# Altium project actuator_board.PrjPcb
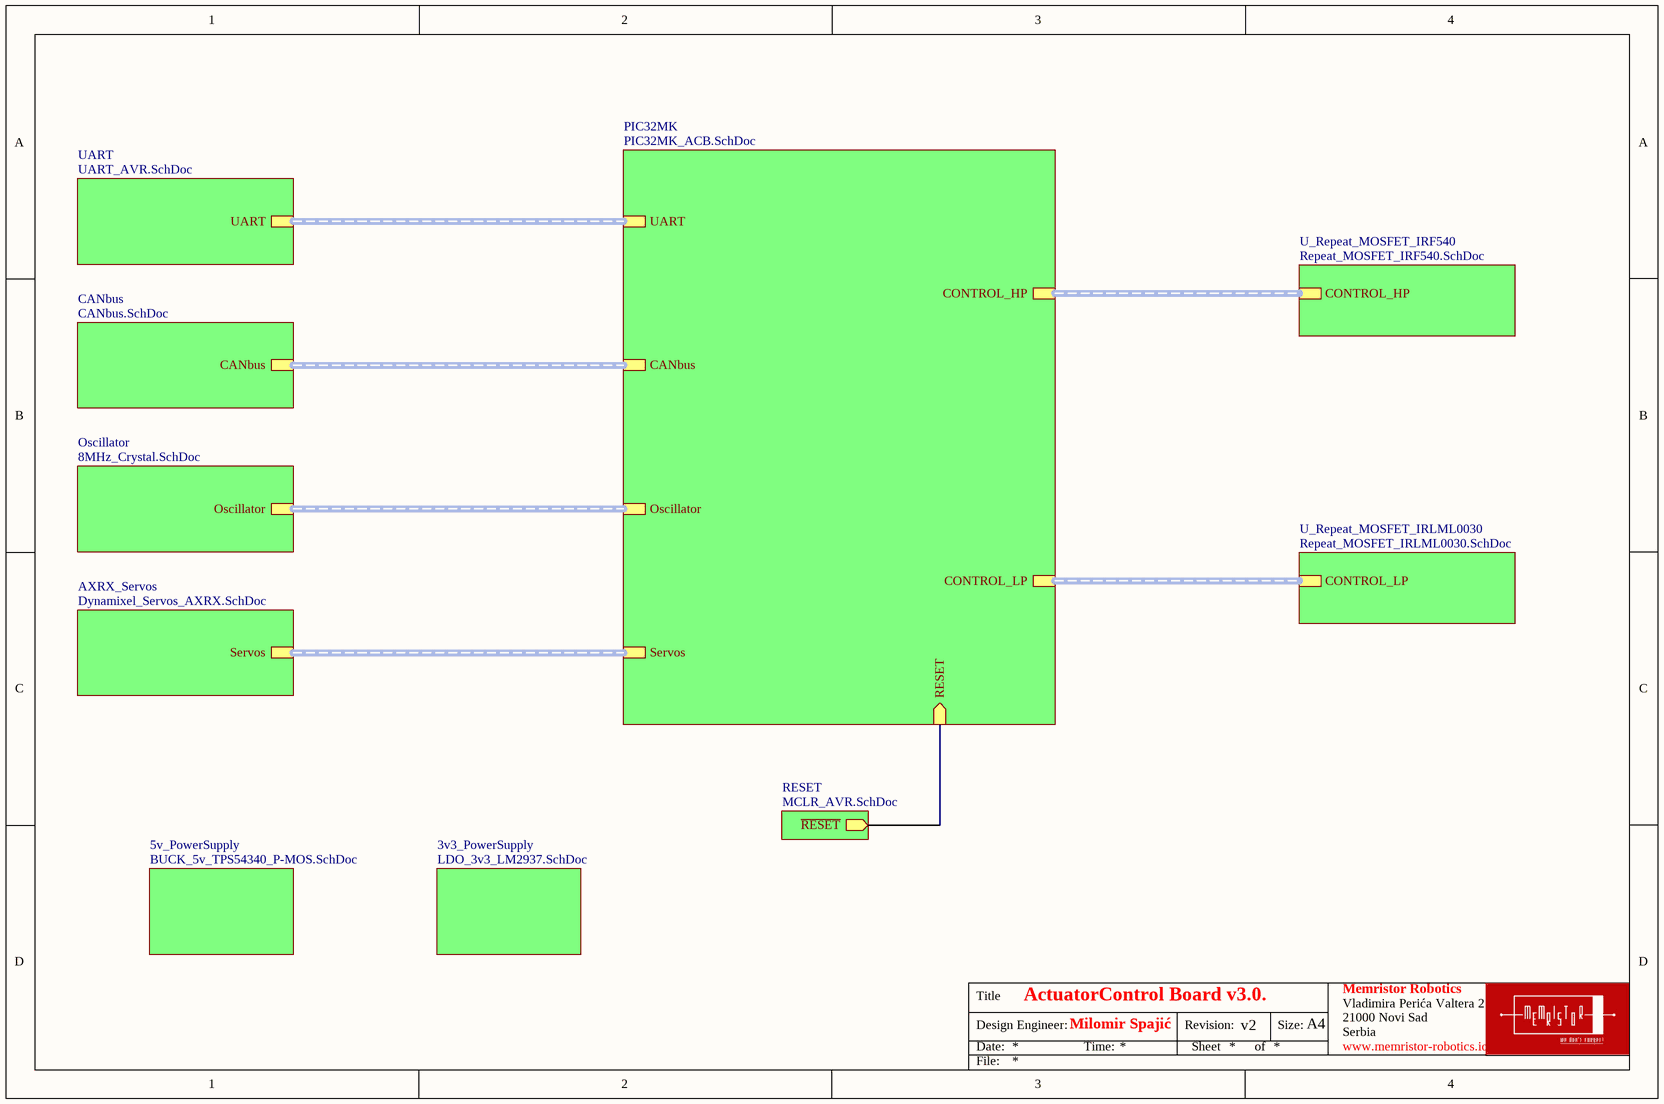
[diagram p0: ActuatorControl_Board_v30.SchDoc]
13 sheets, 147 parts. Net scope: hierarchical (ports join the sheet entries above them; power ports are global).
Board file: ActuatorControl_Board_v30.PcbDoc
Sheets:
  ActuatorControl_Board_v30.SchDoc
    5v_PowerSupply = BUCK_5v_TPS54340_P-MOS.SchDoc
    3v3_PowerSupply = LDO_3v3_LM2937.SchDoc
    RESET = MCLR_AVR.SchDoc
    PIC32MK = PIC32MK_ACB.SchDoc
    UART = UART_AVR.SchDoc
    CANbus = CANbus.SchDoc
    Oscillator = 8MHz_Crystal.SchDoc
    AXRX_Servos = Dynamixel_Servos_AXRX.SchDoc
    U_Repeat_MOSFET_IRF540 = Repeat_MOSFET_IRF540.SchDoc
      MOSFET_IRF5401 = MOSFET_IRF540.SchDoc
      MOSFET_IRF5402 = MOSFET_IRF540.SchDoc
      MOSFET_IRF5403 = MOSFET_IRF540.SchDoc
      MOSFET_IRF5404 = MOSFET_IRF540.SchDoc
      MOSFET_IRF5405 = MOSFET_IRF540.SchDoc
      MOSFET_IRF5406 = MOSFET_IRF540.SchDoc
    U_Repeat_MOSFET_IRLML0030 = Repeat_MOSFET_IRLML0030.SchDoc
      MOSFET_IRLML00301 = MOSFET_IRLML0030.SchDoc
      MOSFET_IRLML00302 = MOSFET_IRLML0030.SchDoc
      MOSFET_IRLML00303 = MOSFET_IRLML0030.SchDoc
      MOSFET_IRLML00304 = MOSFET_IRLML0030.SchDoc
      MOSFET_IRLML00305 = MOSFET_IRLML0030.SchDoc
      MOSFET_IRLML00306 = MOSFET_IRLML0030.SchDoc

## Sheet ActuatorControl_Board_v30.SchDoc: ActuatorControl Board v3.0.
size A4; Author: Milomir Spajić; Organization: Memristor Robotics; Address1: Vladimira Perića Valtera 2; Address2: 21000 Novi Sad; Address3: Serbia; Revision: v2

### Sub-sheets
3v3_PowerSupply = LDO_3v3_LM2937.SchDoc: no entries
5v_PowerSupply = BUCK_5v_TPS54340_P-MOS.SchDoc: no entries
AXRX_Servos = Dynamixel_Servos_AXRX.SchDoc: Servos (harness AXRX_Servos)
CANbus = CANbus.SchDoc: CANbus (harness CANbus)
Oscillator = 8MHz_Crystal.SchDoc: Oscillator (harness Oscillator)
PIC32MK = PIC32MK_ACB.SchDoc: CONTROL_HP (harness CONTROL_HP), CONTROL_LP (harness CONTROL_LP), Oscillator (harness Oscillator), UART (harness UART), Servos (harness AXRX_Servos), CANbus (harness CANbus), RESET (in)
RESET = MCLR_AVR.SchDoc: ~{RESET} (out)
U_Repeat_MOSFET_IRF540 = Repeat_MOSFET_IRF540.SchDoc: CONTROL_HP (harness CONTROL_HP)
U_Repeat_MOSFET_IRLML0030 = Repeat_MOSFET_IRLML0030.SchDoc: CONTROL_LP (harness CONTROL_LP)
UART = UART_AVR.SchDoc: UART (harness UART)

### Nets
~{RESET}: sheet RESET/~{RESET}, sheet PIC32MK/RESET

### Buses and harness runs
harness sheet AXRX_Servos/Servos = sheet PIC32MK/Servos
harness sheet CANbus/CANbus = sheet PIC32MK/CANbus
harness sheet Oscillator/Oscillator = sheet PIC32MK/Oscillator
harness sheet PIC32MK/CONTROL_HP = sheet U_Repeat_MOSFET_IRF540/CONTROL_HP
harness sheet PIC32MK/CONTROL_LP = sheet U_Repeat_MOSFET_IRLML0030/CONTROL_LP
harness sheet PIC32MK/UART = sheet UART/UART

### Notes on the sheet
- Title
- Date:
- Design Engineer:
- Time:
- Revision:
- Sheet
- of
- Size:
- A4
- www.memristor-robotics.io
- File:

## Sheet BUCK_5v_TPS54340_P-MOS.SchDoc: Memristor Power 5.0
size A4; Author: Nikola Rašević; Organization: Memristor-Robotics; Address1: Vladimira Perića Valtera 2; Address2: 21000 Novi Sad; Address3: Serbia; Revision: v1
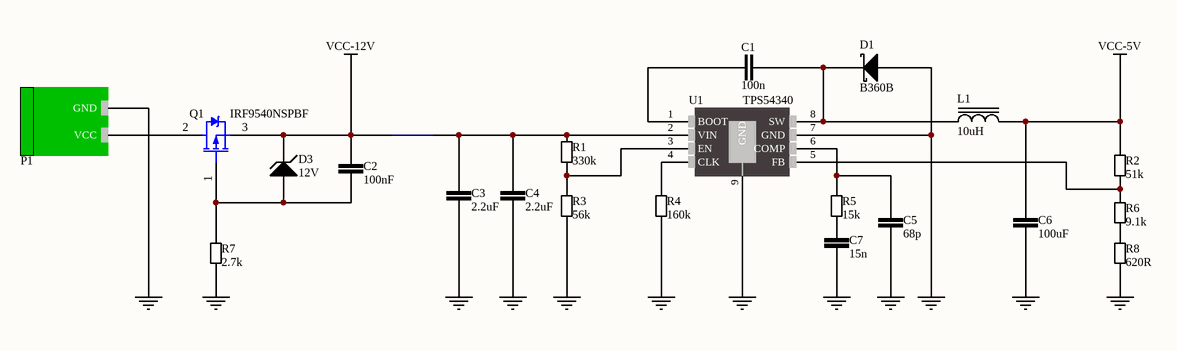
[diagram p1: BUCK_5v_TPS54340_P-MOS.SchDoc]

### Parts
C1  100n  [CER_0603]
C2  100nF  [CER_0805]
C3  2.2uF  [CER_1210]
C4  2.2uF  [CER_1210]
C5  68p  [CER_0603]
C6  100uF  [CER_1210]
C7  15n  [CER_0603]
D1  B360B  [DO214AC]
D3  12V  [DO214AC]
L1  10uH  [INDUCTOR_SS1260-103MLD]
P1  2EDGRC-5.08-02P-14-00A(H)  [PWR_Con]  (value not drawn)
Q1  IRF9540NSPBF  [D2PAK-2]
R1  330k  [RESC2013X38N-0805-NOOVERLAY]
R2  51k  [RESC2013X38N-0805-NOOVERLAY]
R3  56k  [RESC2013X38N-0805-NOOVERLAY]
R4  160k  [RESC2013X38N-0805-NOOVERLAY]
R5  15k  [RESC2013X38N-0805-NOOVERLAY]
R6  9.1k  [RESC2013X38N-0805-NOOVERLAY]
R7  2.7k  [RESC2013X38N-0805-NOOVERLAY]
R8  620R  [RESC2013X38N-0805-NOOVERLAY]
U1  TPS54340  [HSOP-8]

### Nets
GND: C3.1 C4.1 C5.1 C6.1 C7.1 D1.2(Anode) P1.1(GND) R3.1 R4.1 R7.1 R8.1 U1.7(GND) U1.9(GND)
VCC-5V: C6.2 L1.2 R2.2
VCC-12V: C2.2 C3.2 C4.2 D3.1(Cathode) Q1.3(S) R1.2 U1.2(VIN)
NetC1_1: C1.1 U1.1(BOOT)
NetC1_2: C1.2 D1.1(Cathode) L1.1 U1.8(SW)
NetC2_1: C2.1 D3.2(Anode) Q1.1(G) R7.2
NetC5_2: C5.2 R5.2 U1.6(COMP)
NetC7_2: C7.2 R5.1
NetP1_2: P1.2(VCC) Q1.2(D)
NetR1_1: R1.1 R3.2 U1.3(EN)
NetR2_1: R2.1 R6.2 U1.5(FB)
NetR4_2: R4.2 U1.4(CLK)
NetR6_1: R6.1 R8.2

### Notes on the sheet
- Title
- Date:
- Design Engineer:
- Time:
- Revision:
- Sheet
- of
- Size:
- A4
- www.memristor-robotics.io
- File:

### Library data of the parts
C1 = 06032105: CAP CER 100n 10V X5R 10% 0603; Capacitance: 100n
C2 = 00002105: CAP CER 100n 50V X7R 10% 0805; Capacitance: 100nF
C3 C4 = 00001225: CAP CER 2.2u; Value: 2.2uF
C5 = 06032680: CAP CER 68p 0603; Capacitance: 68p
C6 = 00002108: CAP CER 100u X5R 6.3V 10% 1210; Capacitance: 100uF
C7 = 06032153: CAP CER 15n 0603; Capacitance: 15n
D1 = B360B: DIODE SCHOTTKY 60V 3A DO214AC; Manufacturer: Vishay Semiconductor Diodes Division; Barcode: 0100000007488; id: 62; Assembly: SMD; Speed: Fast Recovery =< 500ns, > 200mA (Io); Voltage  Forward: 550mV @ 3A; item_id: 1025; Recommended Rating: Silver; Manufacturer Part Number: B360B; Category: Discrete Semiconductor Products; Datasheet URL: http://www.vishay.com/docs/88896/b330la.pdf; Package Case: DO-214AC, SMA; Family: DIODE; Voltage  DC Reverse: 60V; Current  Average Rectified: 3A; Diode Type: Schottky; Part Type: Discrete Semiconductors
D3 = ZENER: DIODE ZENER; Manufacturer: Vishay Semiconductor Diodes Division; Manufacturer Part Number: B360B; Barcode: 0100000007488; id: 62; Assembly: SMD; Speed: Fast Recovery =< 500ns, > 200mA (Io); Voltage  DC Reverse: 60V; Current  Average Rectified: 3A; Voltage  Forward: 550mV @ 3A; Diode Type: Schottky; item_id: 1025; Recommended Rating: Silver; Category: Discrete Semiconductor Products; Datasheet URL: http://www.vishay.com/docs/88896/b330la.pdf; Package Case: DO-214AC, SMA; Family: DIODE; Part Type: Discrete Semiconductors; Refferent Voltage: 12V
L1 = Inductor_10uH: FIXED IND 10uH 5.3A; Manufacturer: Coilcraft; Manufacturer Part Number: XAL7030-103MEB; Barcode: 2911010049126; id: 7; Assembly: SMD; Tolerance: 20%; Value: 10u; DC Resistance: 62.7mOhm; item_id: 5593; Category: Inductors, Coils, Chokes; Datasheet URL: http://www.mouser.com/ds/2/597/xal7030-270749.pdf; Package Case: 8x8mm; Inductance: 10uH; Current Rating: 5.3A; Family: INDUCTOR; Part Type: Inductor, Transf, Filter, Ferrite
P1 = 00000002: TERM BLOCK HDR 2POS 90DEG 5.08MM; Suplier: TME; Manufacturer Part Number: 2EDGRC-5.08-02P-14-00A(H); Suplier Product Link: https://www.tme.eu/en/details/2edgrc5.08-2p14/pluggable-terminal-blocks/degson-electronics/2edgrc-508-02p-14-00ah/; Price: 0.1304
Q1 = IRF9540N: P-MOS; Manufacturer: INTERNATIONAL RECTIFIER; Manufacturer Part Number: IRF9540NSPBF; Order Code: IRF9540NS; Package: TO-263 SMD; Price: DIN 62.54; Supplier: Comet.rs
R1 = 00003303: RES SMD 330 kOhm 1/8W 0805; Power: 0.125W, 1/8W; Resistance: 330k; Assembly: SMD; Barcode: 00003303
R2 = 00005102: RES SMD 51 kOhm 1/8W 0805; Power: 0.125W, 1/8W; Resistance: 51k; Assembly: SMD; Barcode: 00005102
R3 = 00005602: RES SMD 56 kOhm 1/8W 0805; Power: 0.125W, 1/8W; Barcode: 00004701; Resistance: 56k; Assembly: SMD
R4 = 00001603: RES SMD 160 kOhm 1/8W 0805; Power: 0.125W, 1/8W; Resistance: 160k; Assembly: SMD; Barcode: 00001603
R5 = 00001502: RES SMD 15 kOhm 1/8W 0805; Power: 0.125W, 1/8W; Resistance: 15k; Assembly: SMD; Barcode: 00001502
R6 = 00009101: RES SMD 9.1 kOhm 1/8W 0805; Power: 0.125W, 1/8W; Resistance: 9.1k; Assembly: SMD; Barcode: 00009101
R7 = 00002701: RES SMD 2.7 kOhm 1/8W 0805; Power: 0.125W, 1/8W; Barcode: 00004701; Resistance: 2.7k; Assembly: SMD
R8 = 00006200: RES SMD 620 Ohm 1/8W 0805; Power: 0.125W, 1/8W; Resistance: 620R; Assembly: SMD; Barcode: 00006200
U1 = TPS54340: IC REG BUCK ADJ 3.5A 8SOPWRPAD; Assembly: SMD; Manufacturer Part Number: TPS54340

## Sheet LDO_3v3_LM2937.SchDoc: 3v3 LDO Module
size A4; Author: Nikola Rašević; Organization: Memristor Robotics
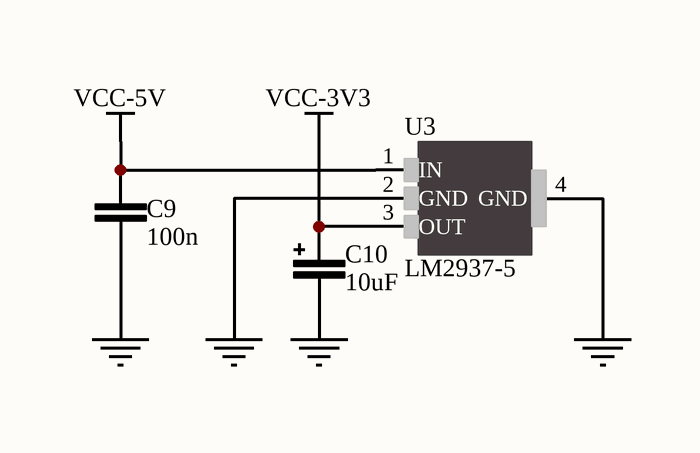
[diagram p2: LDO_3v3_LM2937.SchDoc]

### Parts
C9  100n  [CER_0603]
C10  10uF  [TANT_1210]
U3  LM2937-5  [SOT223]

### Nets
GND: C9.1 C10.2 U3.2(GND) U3.4(GND)
VCC-3V3: C10.1 U3.3(OUT)
VCC-5V: C9.2 U3.1(IN)

### Notes on the sheet
- Title
- Date:
- Design Engineer:
- Time:
- Revision:
- Sheet
- of
- Size:
- A4
- www.memristor-robotics.io
- File:

### Library data of the parts
C9 = 06032105: CAP CER 100n 10V X5R 10% 0603; Capacitance: 100n
C10 = 00001106: CAP TANT 10u; Value: 10uF
U3 = 00000007: IC REG LINEAR 5V 400MA SOT223-4; Manufacturer Part Number: LM2937-5; Datasheet Link: http://www.ti.com/lit/ds/symlink/lm2937.pdf

## Sheet MCLR_AVR.SchDoc: MCU Reset Module
size A4; Author: Nikola Rašević; Organization: Memristor Robotics
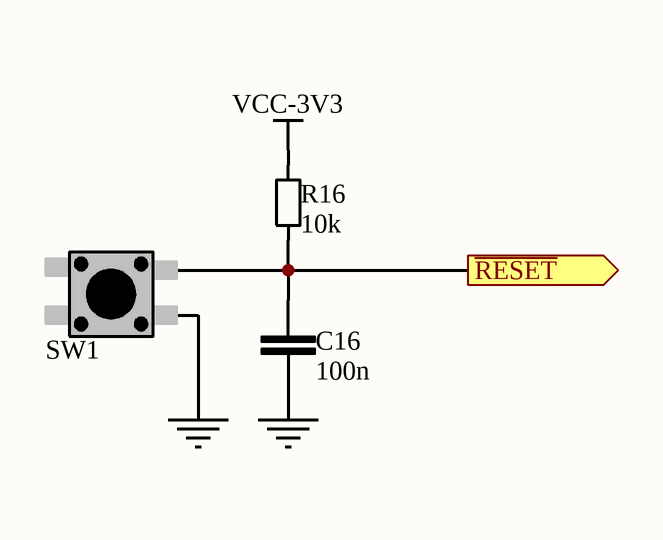
[diagram p3: MCLR_AVR.SchDoc]

### Parts
C16  100n  [CER_0603]
R16  10k  [RESC2013X38N-0805-NOOVERLAY]
SW1  TASTER  [TASTER_SMD]  (value not drawn)

### Ports
~{RESET} (out)

### Nets
GND: C16.1 SW1.1
VCC-3V3: R16.2
~{RESET}: C16.2 R16.1 SW1.2 ; port ~{RESET}

### Notes on the sheet
- Title
- Date:
- Design Engineer:
- Time:
- Revision:
- Sheet
- of
- Size:
- A4
- www.memristor-robotics.io
- File:

### Library data of the parts
C16 = 06032105: CAP CER 100n 10V X5R 10% 0603; Capacitance: 100n
R16 = 000001002: RES SMD 10 kOhm 1/8W 0805; Resistance: 10k

## Sheet PIC32MK_ACB.SchDoc: PIC32MK
size A4; Author: Milomir Spajić; Organization: Memristor-Robotics; Address1: Vladimira Perića Valtera; Address2: Novi Sad, 21000; Address3: Serbia; SheetNumber: 8; SheetTotal: 13
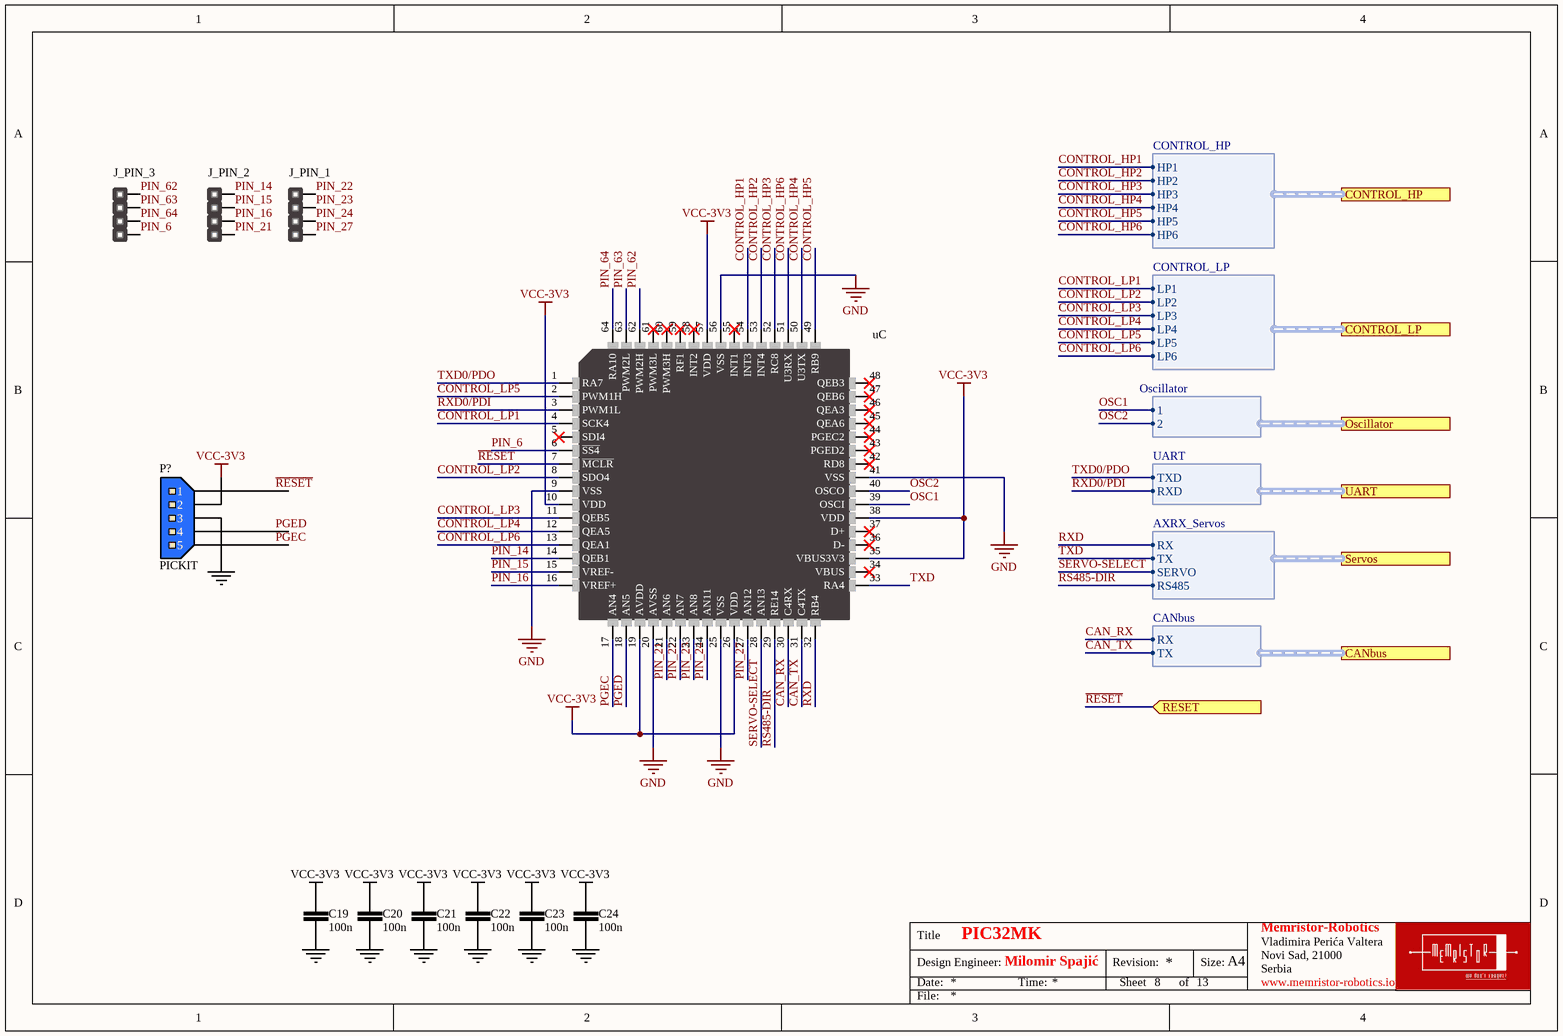
[diagram p4: PIC32MK_ACB.SchDoc]

### Parts
C19  100n  [CER_0603]
C20  100n  [CER_0603]
C21  100n  [CER_0603]
C22  100n  [CER_0603]
C23  100n  [CER_0603]
C24  100n  [CER_0603]
J_PIN_1  HEADER_1x4  [HM1X4]  (value not drawn)
J_PIN_2  HEADER_1x4  [HM1X4]  (value not drawn)
J_PIN_3  HEADER_1x4  [HM1X4]  (value not drawn)
P?  PICKIT  [TE CONNECTIVITY_5PIN_MALE]
uC  (no value)  [TQFP-64-500um]

### Ports
CANbus (harness CANbus), CONTROL_HP (harness CONTROL_HP), CONTROL_LP (harness CONTROL_LP), Oscillator (harness Oscillator), RESET (in), Servos (harness AXRX_Servos), UART (harness UART)

### Harnesses
CONTROL_HP: HP1, HP2, HP3, HP4, HP5, HP6
CONTROL_LP: LP1, LP2, LP3, LP4, LP5, LP6
Oscillator: 1, 2
UART: TXD, RXD
AXRX_Servos: RX, TX, SERVO, RS485
CANbus: RX, TX

### Nets
GND: C19.1 C20.1 C21.1 C22.1 C23.1 C24.1 P?.3 uC.9(VSS) uC.20(AVSS) uC.25(VSS) uC.41(VSS) uC.56(VSS)
VCC-3V3: C19.2 C20.2 C21.2 C22.2 C23.2 C24.2 P?.2 uC.10(VDD) uC.19(AVDD) uC.26(VDD) uC.35(VBUS3V3) uC.38(VDD) uC.57(VDD)
CAN_RX: uC.30(C4RX) ; port CANbus.RX
CAN_TX: uC.31(C4TX) ; port CANbus.TX
CONTROL_HP1: uC.54(INT3) ; port CONTROL_HP.HP1
CONTROL_HP2: uC.53(INT4) ; port CONTROL_HP.HP2
CONTROL_HP3: uC.52(RC8) ; port CONTROL_HP.HP3
CONTROL_HP4: uC.50(U3TX) ; port CONTROL_HP.HP4
CONTROL_HP5: uC.49(RB9) ; port CONTROL_HP.HP5
CONTROL_HP6: uC.51(U3RX) ; port CONTROL_HP.HP6
CONTROL_LP1: uC.4(SCK4) ; port CONTROL_LP.LP1
CONTROL_LP2: uC.8(SDO4) ; port CONTROL_LP.LP2
CONTROL_LP3: uC.11(QEB5) ; port CONTROL_LP.LP3
CONTROL_LP4: uC.12(QEA5) ; port CONTROL_LP.LP4
CONTROL_LP5: uC.2(PWM1H) ; port CONTROL_LP.LP5
CONTROL_LP6: uC.13(QEA1) ; port CONTROL_LP.LP6
OSC1: uC.39(OSCI) ; port Oscillator.1
OSC2: uC.40(OSCO) ; port Oscillator.2
PGEC: P?.5 uC.17(AN4)
PGED: P?.4 uC.18(AN5)
PIN_6: J_PIN_3.1 uC.6(~{SS4})
PIN_14: J_PIN_2.4 uC.14(QEB1)
PIN_15: J_PIN_2.3 uC.15(VREF-)
PIN_16: J_PIN_2.2 uC.16(VREF+)
PIN_21: J_PIN_2.1 uC.21(AN6)
PIN_22: J_PIN_1.4 uC.22(AN7)
PIN_23: J_PIN_1.3 uC.23(AN8)
PIN_24: J_PIN_1.2 uC.24(AN11)
PIN_27: J_PIN_1.1 uC.27(AN12)
PIN_62: J_PIN_3.4 uC.62(PWM2H)
PIN_63: J_PIN_3.3 uC.63(PWM2L)
PIN_64: J_PIN_3.2 uC.64(RA10)
~{RESET}: P?.1 uC.7(~{MCLR}) ; port RESET
RS485-DIR: uC.29(RE14) ; port Servos.RS485
RXD: uC.32(RB4) ; port Servos.RX
RXD0/PDI: uC.3(PWM1L) ; port UART.RXD
SERVO-SELECT: uC.28(AN13) ; port Servos.SERVO
TXD: uC.33(RA4) ; port Servos.TX
TXD0/PDO: uC.1(RA7) ; port UART.TXD

Not connected (* = marked no-connect by the designer): uC 5(SDI4)* 34(VBUS)* 36(D-)* 37(D+)* 42(RD8)* 43(PGED2)* 44(PGEC2)* 45(QEA6)* 46(QEA3)* 47(QEB6)* 48(QEB3)* 55(INT1)* 58(INT2)* 59(RF1)* 60(PWM3H)* 61(PWM3L)*

### Notes on the sheet
- Title
- Date:
- Design Engineer:
- Time:
- Revision:
- Sheet
- of
- Size:
- A4
- www.memristor-robotics.io
- File:

### Library data of the parts
C19-C24 = 06032105: CAP CER 100n 10V X5R 10% 0603; Capacitance: 100n
P? = TE CONNECTIVITY_5PIN_MALE: BLUE_5PIN_CONECTOR; Manufacturer: TE CONNECTIVITY / AMP; Manufacturer Part Number 1: 281695-3; Order Code 1: 1205983; Price 1: £0.403; Supplier 1: uk.farnell.com
uC = PIC32MK1024MCF064: IC MCU 32BIT 1MB FLASH 64TQFP; Manufacturer Part Number: PIC32MK1024MCF064

## Sheet UART_AVR.SchDoc: MCU UART Module
size A4; Author: Nikola Rašević; Organization: Memristor Robotics
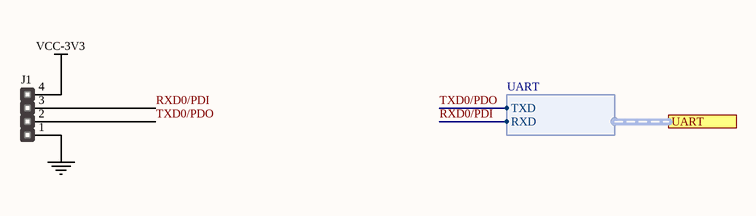
[diagram p5: UART_AVR.SchDoc]

### Parts
J1  HEADER_1x4  [HM1X4]  (value not drawn)

### Ports
UART (harness UART)

### Harnesses
UART: TXD, RXD

### Nets
GND: J1.1
VCC-3V3: J1.4
RXD0/PDI: J1.3 ; port UART.RXD
TXD0/PDO: J1.2 ; port UART.TXD

### Notes on the sheet
- Title
- Date:
- Design Engineer:
- Time:
- Revision:
- Sheet
- of
- Size:
- A4
- www.memristor-robotics.io
- File:

## Sheet CANbus.SchDoc: CANbus Module
size A4; Author: Nikola Rašević; Organization: Memristor Robotics
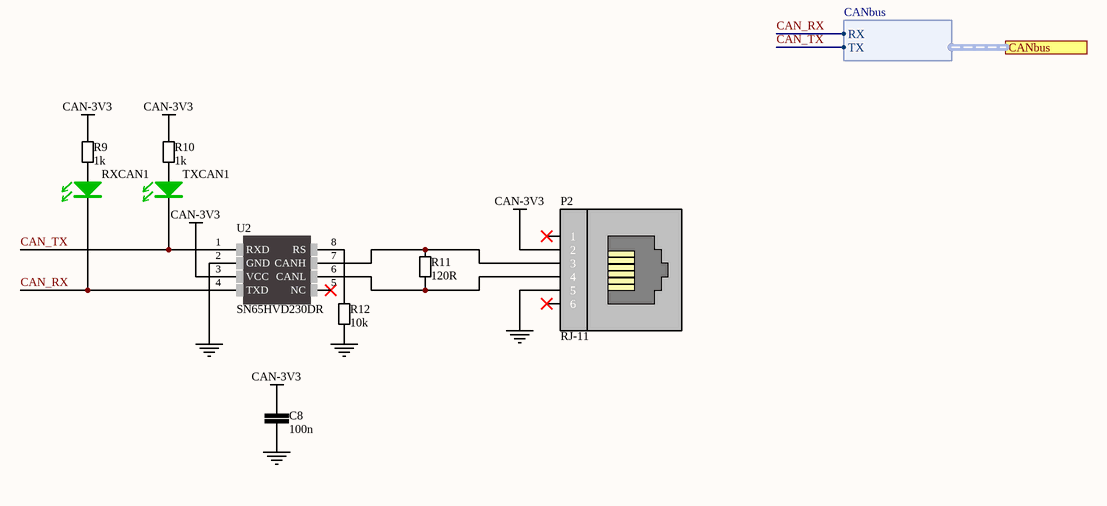
[diagram p6: CANbus.SchDoc]

### Parts
C8  100n  [CER_0603]
P2  RJ-11  [RJ11-6N-B]
R9  1k  [RESC2013X38N-0805-NOOVERLAY]
R10  1k  [RESC2013X38N-0805-NOOVERLAY]
R11  120R  [RESC2013X38N-0805-NOOVERLAY]
R12  10k  [RESC2013X38N-0805-NOOVERLAY]
RXCAN1  LED GREEN  [LED_GREEN_0805]  (value not drawn)
TXCAN1  LED GREEN  [LED_GREEN_0805]  (value not drawn)
U2  SN65HVD230DR  [SOIC-8]

### Ports
CANbus (harness CANbus)

### Harnesses
CANbus: RX, TX

### Nets
CAN-3V3: C8.2 P2.2 R9.2 R10.2 U2.3(VCC)
GND: C8.1 P2.5 R12.1 U2.2(GND)
CAN_RX: RXCAN1.1(C) U2.4(TXD) ; port CANbus.RX
CAN_TX: TXCAN1.1(C) U2.1(RXD) ; port CANbus.TX
NetP2_3: P2.3 R11.1 U2.7(CANH)
NetP2_4: P2.4 R11.2 U2.6(CANL)
NetR9_1: R9.1 RXCAN1.2(A)
NetR10_1: R10.1 TXCAN1.2(A)
NetR12_2: R12.2 U2.8(RS)

Not connected (* = marked no-connect by the designer): P2 1* 6*; U2 5(NC)*

### Notes on the sheet
- Title
- Date:
- Design Engineer:
- Time:
- Revision:
- Sheet
- of
- Size:
- A4
- www.memristor-robotics.io
- File:

### Library data of the parts
C8 = 06032105: CAP CER 100n 10V X5R 10% 0603; Capacitance: 100n
P2 = 00000001: Manufacturer Part Number: RJ-11
R9 R10 = 00001001: RES SMD 1 kOhm 1/8W 0805; Power: 0.125W, 1/8W; Barcode: 00009101; Resistance: 1k; Assembly: SMD
R11 = 000001200: RES SMD 120 Ohm 1/8W 0805; Resistance: 120R
R12 = 000001002: RES SMD 10 kOhm 1/8W 0805; Resistance: 10k
RXCAN1 TXCAN1 = LED_GREEN 0805: LED GREEN CLEAR 0805 SMD; Manufacturer: Kingbright; Manufacturer Part Number: APT2012SGC; Barcode: 2911010024338; id: 28; Voltage Forward: 2.2V; Wavelength: 568nm; Lens Color: Colorless; item_id: 3342; Recommended Rating: Platinum; Category: Optoelectronics; Assembly: SMD; Datasheet URL: http://www.kingbrightusa.com/images/catalog/SPEC/APT2012SGC.pdf; Package Case: 0805 (2012 Metric); Color: Green; Family: LED; Lens Transparency: Clear; Part Type: Optoelectronics
U2 = SN65HVD230: IC EMC CAN TRANSCEIVER 8-SOIC; Assembly: SMD; Barcode: 00000001; Manufacturer Part Number: SN65HVD230DR; Comet Product Page: http://store.comet.rs/Catalogue/Product/9057/; Datasheet Link: http://www.ti.com/lit/ds/symlink/sn65hvd232.pdf; Category: Integrated Circuits (ICs); Package: SOIC-8; Family: Comunication

## Sheet 8MHz_Crystal.SchDoc: 8MHz Crystal Oscillator Module
size A4; Author: Nikola Rašević; Organization: Memristor Robotics
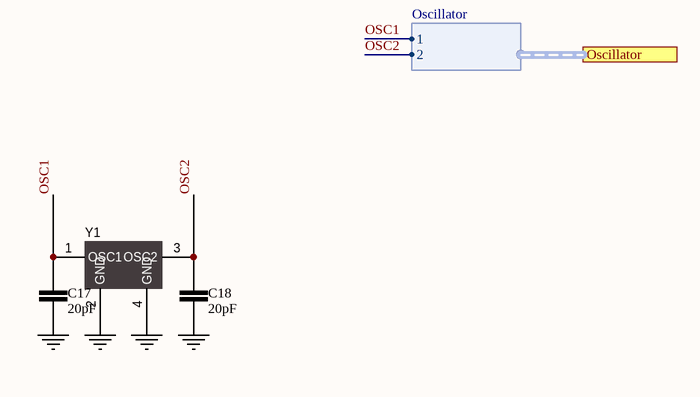
[diagram p7: 8MHz_Crystal.SchDoc]

### Parts
C17  20pF  [CER_0603]
C18  20pF  [CER_0603]
Y1  8Hz  [ABM10]  (value not drawn)

### Ports
Oscillator (harness Oscillator)

### Harnesses
Oscillator: 1, 2

### Nets
GND: C17.1 C18.1 Y1.2(GND) Y1.4(GND)
OSC1: C17.2 Y1.1(OSC1) ; port Oscillator.1
OSC2: C18.2 Y1.3(OSC2) ; port Oscillator.2

### Notes on the sheet
- Title
- Date:
- Design Engineer:
- Time:
- Revision:
- Sheet
- of
- Size:
- A4
- www.memristor-robotics.io
- File:

### Library data of the parts
C17 C18 = 00002200: CAP CER 20p 0805; Capacitance: 20pF
Y1 = QUARTZ_8MHz: CRYSTAL 8.0000MHZ 18PF SMD; Manufacturer: ABRACON; Manufacturer Part Number: ABMM2-8.000MHZ-E2-T; id: 17; Frequency Stability: ±30ppm; Equivalent Series Resistance: 72 Ohm; item_id: 4360; Category: Crystals and Oscillators; Assembly: SMD; Datasheet URL: http://www.abracon.com/Resonators/ABMM2.pdf; Package Case: 4-SMD, No Lead (DFN, LCC); Frequency: 8Hz; Frequency Tolerance: ±30ppm; Load Capacitance: 18pF; Family: CRYSTAL; Size Dimension: 0.126" L x 0.098" W (3.20mm x 2.50mm); Part Type: Crystals, Oscillators

## Sheet Dynamixel_Servos_AXRX.SchDoc: Dynamixel Servoes Module
size A4; Author: Nikola Rašević; Organization: Memristor Robotics
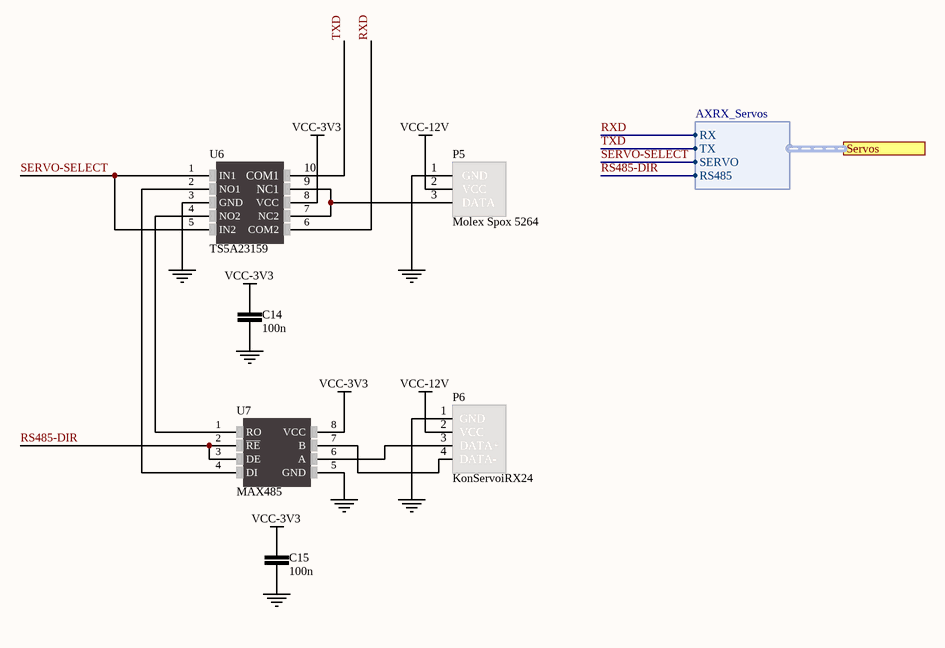
[diagram p8: Dynamixel_Servos_AXRX.SchDoc]

### Parts
C14  100n  [CER_0603]
C15  100n  [CER_0603]
P5  Molex Spox 5264  [AX12_Molex Spox 5264]
P6  KonServoiRX24  [RX24_Molex Spox 5264]
U6  TS5A23159  [TSSOP10]
U7  MAX485  [SOIC-8]

### Ports
Servos (harness AXRX_Servos)

### Harnesses
AXRX_Servos: RX, TX, SERVO, RS485

### Nets
GND: C14.1 C15.1 P5.1(GND) P6.1(GND) U6.3(GND) U7.5(GND)
VCC-3V3: C14.2 C15.2 U6.8(VCC) U7.8(VCC)
VCC-12V: P5.2(VCC) P6.2(VCC)
RS485-DIR: U7.2(~{RE}) U7.3(DE) ; port Servos.RS485
RXD: U6.6(COM2) ; port Servos.RX
SERVO-SELECT: U6.1(IN1) U6.5(IN2) ; port Servos.SERVO
TXD: U6.10(COM1) ; port Servos.TX
NetP5_3: P5.3(DATA) U6.7(NC2) U6.9(NC1)
NetP6_3: P6.3(DATA+) U7.6(A)
NetP6_4: P6.4(DATA-) U7.7(B)
NetU6_2: U6.2(NO1) U7.4(DI)
NetU6_4: U6.4(NO2) U7.1(RO)

### Notes on the sheet
- Title
- Date:
- Design Engineer:
- Time:
- Revision:
- Sheet
- of
- Size:
- A4
- www.memristor-robotics.io
- File:

### Library data of the parts
C14 C15 = 06032105: CAP CER 100n 10V X5R 10% 0603; Capacitance: 100n
P5 = AX12_CONECTOR: KonServoiAX12; Manufacturer Part Number 1: 22035045; Order Code 1: 1104204; Manufacturer: Molex; Supplier 1: uk.farnell.com; Price 1: £0.104
P6 = RX24_CONECTOR: Molex Spox 5264; Manufacturer Part Number 1: 22035045; Order Code 1: 1104204; Manufacturer: Molex; Supplier 1: uk.farnell.com; Price 1: £0.104
U6 = 00000008_1: IC SWITCH DUAL SPDT 10MSOP; Manufacturer Part Number: TS5A23159
U7 = 00000008: IC TXRX RS485/RS422 8-SOIC; Manufacturer Part Number: MAX485

## Sheet Repeat_MOSFET_IRF540.SchDoc: Repeat High Power MOSFET
size A4; Author: Milomir Spajić; Organization: Memristor-Robotics; Address1: Vladimira Perića Valtera; Address2: Novi Sad, 21000; Address3: Serbia
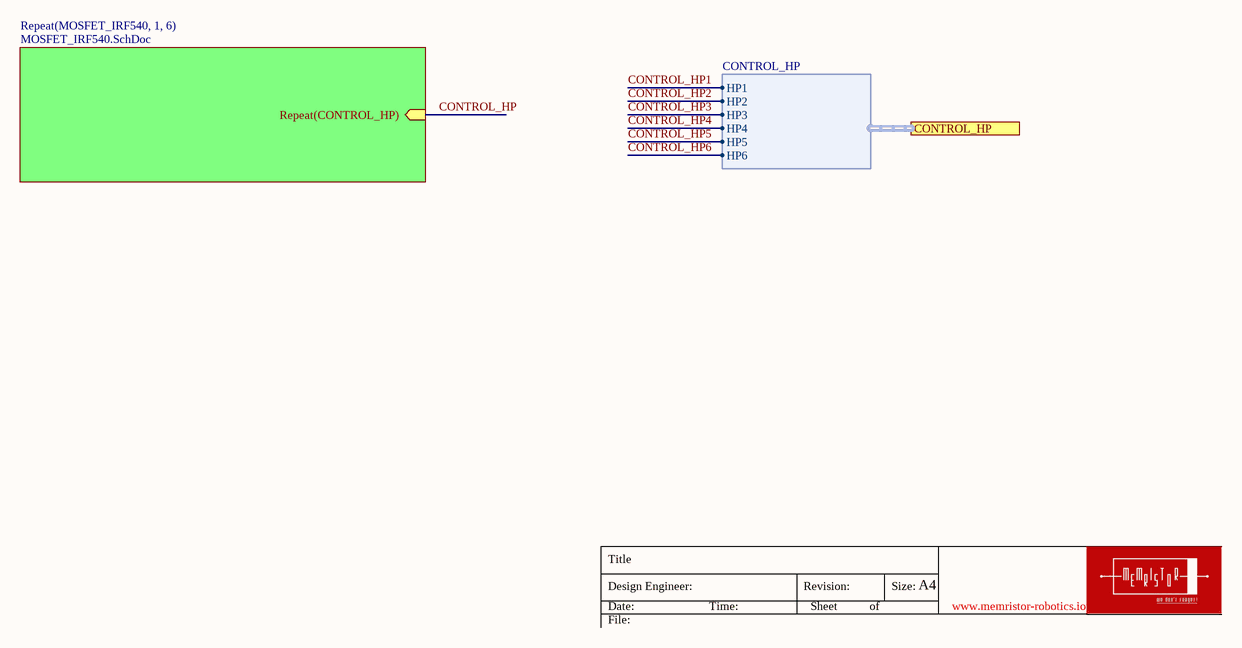
[diagram p9: Repeat_MOSFET_IRF540.SchDoc]

### Sub-sheets
Repeat(MOSFET_IRF540, 1, 6) = MOSFET_IRF540.SchDoc: Repeat(CONTROL_HP) (in)

### Ports
CONTROL_HP (harness CONTROL_HP)

### Harnesses
CONTROL_HP: HP1, HP2, HP3, HP4, HP5, HP6

### Notes on the sheet
- Title
- Date:
- Design Engineer:
- Time:
- Revision:
- Sheet
- of
- Size:
- A4
- www.memristor-robotics.io
- File:

## Sheet MOSFET_IRF540.SchDoc: High Power MOSFET
size A4; Author: Nikola Rašević; Organization: Memristor Robotics
Used 6 times, as channels U_Repeat_MOSFET_IRF540/MOSFET_IRF5401, U_Repeat_MOSFET_IRF540/MOSFET_IRF5402, U_Repeat_MOSFET_IRF540/MOSFET_IRF5403, U_Repeat_MOSFET_IRF540/MOSFET_IRF5404, U_Repeat_MOSFET_IRF540/MOSFET_IRF5405, U_Repeat_MOSFET_IRF540/MOSFET_IRF5406. Parts and nets are listed once, with the designators drawn on the sheet.
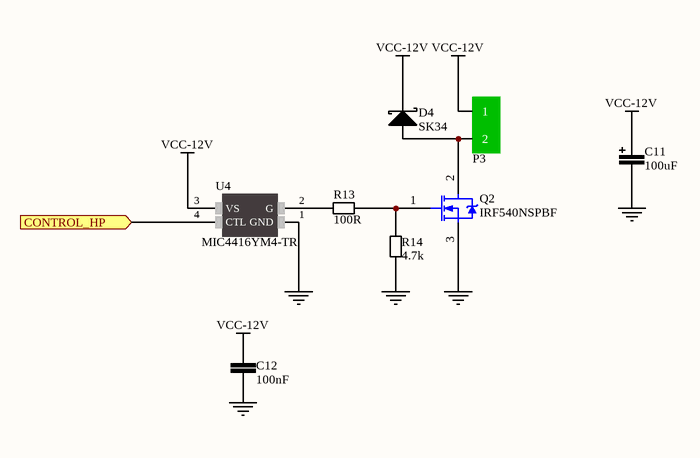
[diagram p10: MOSFET_IRF540.SchDoc]

### Parts
C11  100uF  [CAP5X11_RADIAL]
C12  100nF  [CER_0805]
D4  SK34  [DO214AC]
P3  DRV_B3  [MOTOR_CON]  (value not drawn)
Q2  IRF540NSPBF  [D2PAK-2]
R13  100R  [RESC2013X38N-0805-NOOVERLAY]
R14  4.7k  [RESC2013X38N-0805-NOOVERLAY]
U4  MIC4416YM4-TR  [SOT143-4]

### Ports
CONTROL_HP (in)

### Nets
GND: C11.2 C12.1 Q2.3(S) R14.1 U4.1(GND)
VCC-12V: C11.1 C12.2 D4.1(Cathode) P3.1 U4.3(VS)
CONTROL_HP: U4.4(CTL) ; port CONTROL_HP
NetD4_2: D4.2(Anode) P3.2 Q2.2(D)
NetQ2_1: Q2.1(G) R13.2 R14.2
NetR13_1: R13.1 U4.2(G)

### Channels
U_Repeat_MOSFET_IRF540/MOSFET_IRF5401: designators end in _MOSFET_IRF5401; ports CONTROL_HP=CONTROL_HP1
U_Repeat_MOSFET_IRF540/MOSFET_IRF5402: designators end in _MOSFET_IRF5402; ports CONTROL_HP=CONTROL_HP2
U_Repeat_MOSFET_IRF540/MOSFET_IRF5403: designators end in _MOSFET_IRF5403; ports CONTROL_HP=CONTROL_HP3
U_Repeat_MOSFET_IRF540/MOSFET_IRF5404: designators end in _MOSFET_IRF5404; ports CONTROL_HP=CONTROL_HP4
U_Repeat_MOSFET_IRF540/MOSFET_IRF5405: designators end in _MOSFET_IRF5405; ports CONTROL_HP=CONTROL_HP5
U_Repeat_MOSFET_IRF540/MOSFET_IRF5406: designators end in _MOSFET_IRF5406; ports CONTROL_HP=CONTROL_HP6

### Notes on the sheet
- Title
- Date:
- Design Engineer:
- Time:
- Revision:
- Sheet
- of
- Size:
- A4
- www.memristor-robotics.io
- File:

### Library data of the parts
C11 = 00004704: CAP ALU 4.7u 25V 20%; Capacitance: 100uF
C12 = 00002105: CAP CER 100n 50V X7R 10% 0805; Capacitance: 100nF
D4 = SK34: DIODE SCHOTTKY 40V 3A DO214AC; Manufacturer: Vishay Semiconductor Diodes Division; Barcode: 0100000007488; id: 62; Assembly: SMD; Speed: Fast Recovery =< 500ns, > 200mA (Io); Voltage  Forward: 550mV @ 3A; item_id: 1025; Recommended Rating: Silver; Manufacturer Part Number: SK34; Category: Discrete Semiconductor Products; Datasheet URL: http://www.vishay.com/docs/88896/b330la.pdf; Package Case: DO-214AC, SMA; Family: DIODE; Voltage  DC Reverse: 40V; Current  Average Rectified: 3A; Diode Type: Schottky; Part Type: Discrete Semiconductors
P3 = MOT_CONN: CONNECTOR FOR MOTOR OUTPUT; Manufacturer Part Number: *
Q2 = IRF540N: N-MOS; Manufacturer: INTERNATIONAL RECTIFIER; Manufacturer Part Number: IRF540NSPBF; Order Code: IRF540NS; Package: TO-263 SMD; Price: DIN 62.54; Supplier: Comet.rs
R13 = 00001000: RES SMD 100 Ohm 1/8W 0805; Power: 0.125W, 1/8W; Resistance: 100R; Assembly: SMD; Barcode: 00001000
R14 = 00004701: RES SMD 4.7 kOhm 1/8W 0805; Power: 0.125W, 1/8W; Resistance: 4.7k; Assembly: SMD; Barcode: 00004701
U4 = MIC4416: IC DRIVER MOSF LOW SIDE SOT143-4; Assembly: SMD; Manufacturer Part Number: MIC4416YM4-TR; Datasheet Link: http://ww1.microchip.com/downloads/en/DeviceDoc/mic4416.pdf; Category: Integrated Circuits (ICs); Package: SOT-143; Family: MOSFET Driver; Product Page Farnell: http://uk.farnell.com/microchip/mic4416ym4-tr/driver-mosfet-low-side-smd-4416/dp/2510112

## Sheet Repeat_MOSFET_IRLML0030.SchDoc: Repeat Low Power MOSFET
size A4; Author: Milomir Spajić; Organization: Memristor-Robotics; Address1: Vladimira Perića Valtera; Address2: Novi Sad, 21000; Address3: Serbia; SheetNumber: 11; SheetTotal: 13
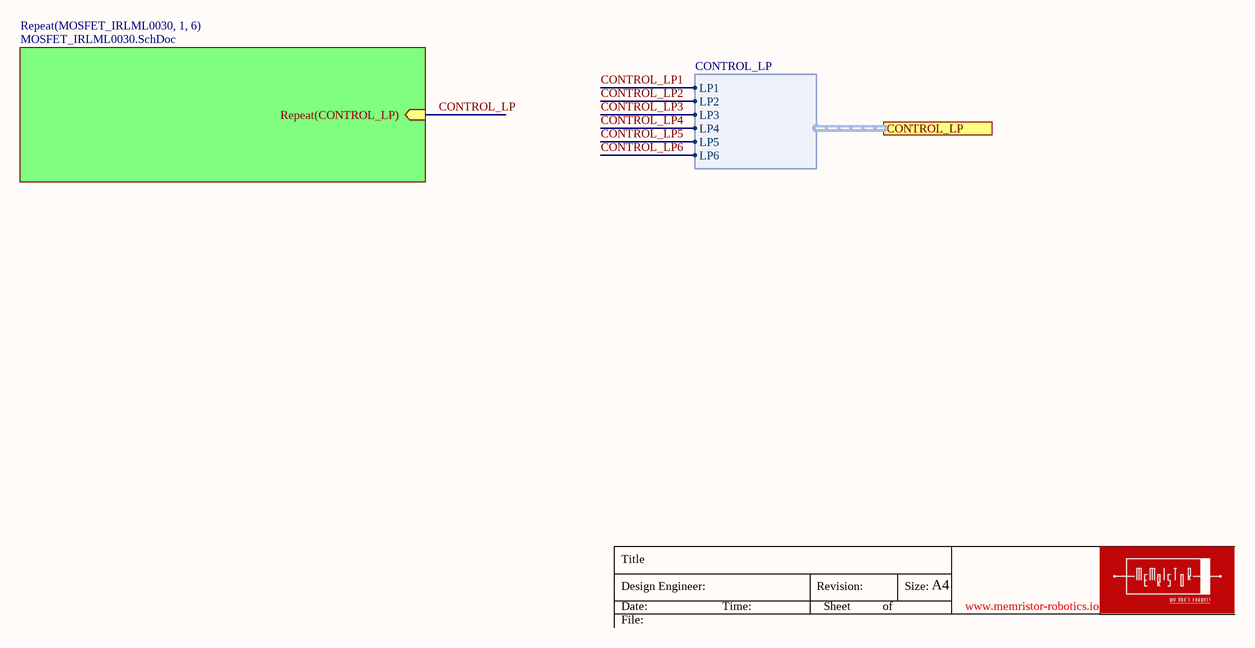
[diagram p11: Repeat_MOSFET_IRLML0030.SchDoc]

### Sub-sheets
Repeat(MOSFET_IRLML0030, 1, 6) = MOSFET_IRLML0030.SchDoc: Repeat(CONTROL_LP) (in)

### Ports
CONTROL_LP (harness CONTROL_LP)

### Harnesses
CONTROL_LP: LP1, LP2, LP3, LP4, LP5, LP6

### Notes on the sheet
- Title
- Date:
- Design Engineer:
- Time:
- Revision:
- Sheet
- of
- Size:
- A4
- www.memristor-robotics.io
- File:

## Sheet MOSFET_IRLML0030.SchDoc: Low Power MOSFET
size A4; Author: Nikola Rašević; Organization: Memristor Robotics
Used 6 times, as channels U_Repeat_MOSFET_IRLML0030/MOSFET_IRLML00301, U_Repeat_MOSFET_IRLML0030/MOSFET_IRLML00302, U_Repeat_MOSFET_IRLML0030/MOSFET_IRLML00303, U_Repeat_MOSFET_IRLML0030/MOSFET_IRLML00304, U_Repeat_MOSFET_IRLML0030/MOSFET_IRLML00305, U_Repeat_MOSFET_IRLML0030/MOSFET_IRLML00306. Parts and nets are listed once, with the designators drawn on the sheet.
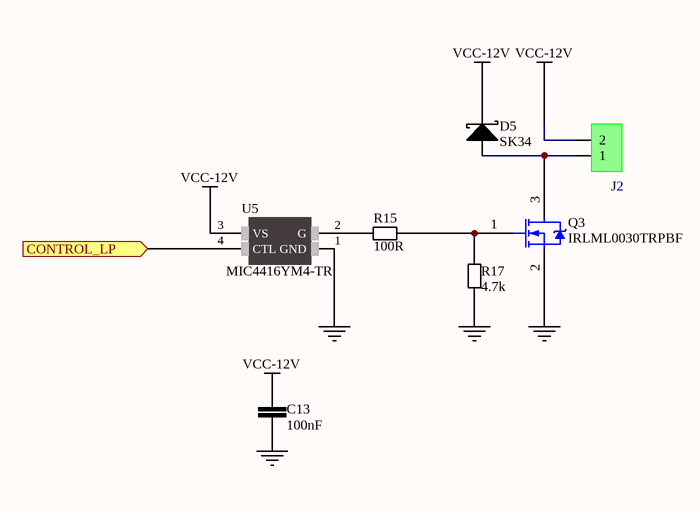
[diagram p12: MOSFET_IRLML0030.SchDoc]

### Parts
C13  100nF  [CER_0805]
D5  SK34  [DO214AC]
J2  282834-2  [CONNECTOR_282834-2]  (value not drawn)
Q3  IRLML0030TRPBF  [SOT-23]
R15  100R  [RESC2013X38N-0805-NOOVERLAY]
R17  4.7k  [RESC2013X38N-0805-NOOVERLAY]
U5  MIC4416YM4-TR  [SOT143-4]

### Ports
CONTROL_LP (in)

### Nets
GND: C13.1 Q3.2(D) R17.1 U5.1(GND)
VCC-12V: C13.2 D5.1(Cathode) J2.2 U5.3(VS)
CONTROL_LP: U5.4(CTL) ; port CONTROL_LP
NetD5_2: D5.2(Anode) J2.1 Q3.3(S)
NetQ3_1: Q3.1(G) R15.2 R17.2
NetR15_1: R15.1 U5.2(G)

### Channels
U_Repeat_MOSFET_IRLML0030/MOSFET_IRLML00301: designators end in _MOSFET_IRLML00301; ports CONTROL_LP=CONTROL_LP1
U_Repeat_MOSFET_IRLML0030/MOSFET_IRLML00302: designators end in _MOSFET_IRLML00302; ports CONTROL_LP=CONTROL_LP2
U_Repeat_MOSFET_IRLML0030/MOSFET_IRLML00303: designators end in _MOSFET_IRLML00303; ports CONTROL_LP=CONTROL_LP3
U_Repeat_MOSFET_IRLML0030/MOSFET_IRLML00304: designators end in _MOSFET_IRLML00304; ports CONTROL_LP=CONTROL_LP4
U_Repeat_MOSFET_IRLML0030/MOSFET_IRLML00305: designators end in _MOSFET_IRLML00305; ports CONTROL_LP=CONTROL_LP5
U_Repeat_MOSFET_IRLML0030/MOSFET_IRLML00306: designators end in _MOSFET_IRLML00306; ports CONTROL_LP=CONTROL_LP6

### Notes on the sheet
- Title
- Date:
- Design Engineer:
- Time:
- Revision:
- Sheet
- of
- Size:
- A4
- www.memristor-robotics.io
- File:

### Library data of the parts
C13 = 00002105: CAP CER 100n 50V X7R 10% 0805; Capacitance: 100nF
D5 = SK34: as D4 on sheet MOSFET_IRF540; Manufacturer Part Number: SK34; Category: Discrete Semiconductor Products; Datasheet URL: http://www.vishay.com/docs/88896/b330la.pdf; Package Case: DO-214AC, SMA; Family: DIODE; Voltage  DC Reverse: 40V; Current  Average Rectified: 3A; Diode Type: Schottky; Part Type: Discrete Semiconductors
J2 = TE 282834-2: Wire-To-Board Terminal Block, 2, 150 V, 10 A, 30 Awg, 16 Awg, 1.4 Mm; Number_of_Positions: 2; MF: TE Connectivity; Centerline_Pitch: 2.54 mm[.1 in]; MP: 282834-2; TE_purchase_URL: https://www.te.com/usa-en/product-282834-2.html?te_bu=Cor&te_type=disp&te_campaign=seda_glo_cor-seda-global-disp-prtnr-fy19-seda-model-bom-cta_sma-317_1&elqCampaignId=32493; Digi-Key_Purchase_URL: https://www.digikey.rs/product-detail/en/te-connectivity-amp-connectors/282834-2/A98333-ND/1150135?utm_source=snapeda&utm_medium=aggregator&utm_campaign=symbol; SnapEDA_Link: https://www.snapeda.com/parts/282834-2/TE%20Connectivity%20AMP%20Connectors/view-part/431057/?ref=snap; EU_RoHS_Compliance: Compliant with Exemptions; Digi-Key_Part_Number: A98333-ND; Package: None; Value: *
Q3 = IRLML0030: N-MOS; Manufacturer: INFINEON; Manufacturer Part Number: IRLML0030TRPBF; Order Code: IRLML0030; Package: SOT-23; Price: 0.11; Supplier: Comet.rs
R15 = 00001000: as R13 on sheet MOSFET_IRF540; Resistance: 100R; Assembly: SMD; Barcode: 00001000
R17 = 00004701: as R14 on sheet MOSFET_IRF540; Resistance: 4.7k; Assembly: SMD; Barcode: 00004701
U5 = MIC4416: as U4 on sheet MOSFET_IRF540; Manufacturer Part Number: MIC4416YM4-TR; Datasheet Link: http://ww1.microchip.com/downloads/en/DeviceDoc/mic4416.pdf; Category: Integrated Circuits (ICs); Package: SOT-143; Family: MOSFET Driver; Product Page Farnell: http://uk.farnell.com/microchip/mic4416ym4-tr/driver-mosfet-low-side-smd-4416/dp/2510112

## Nets that join several sheets
GND: BUCK_5v_TPS54340_P-MOS (13 pins), LDO_3v3_LM2937 (C9.1 C10.2 U3.2 U3.4), MCLR_AVR (C16.1 SW1.1), PIC32MK_ACB (12 pins), UART_AVR (J1.1), CANbus (C8.1 P2.5 R12.1 U2.2), 8MHz_Crystal (C17.1 C18.1 Y1.2 Y1.4), Dynamixel_Servos_AXRX (6 pins), U_Repeat_MOSFET_IRF540/MOSFET_IRF5401 (5 pins), U_Repeat_MOSFET_IRF540/MOSFET_IRF5402 (5 pins), U_Repeat_MOSFET_IRF540/MOSFET_IRF5403 (5 pins), U_Repeat_MOSFET_IRF540/MOSFET_IRF5404 (5 pins), U_Repeat_MOSFET_IRF540/MOSFET_IRF5405 (5 pins), U_Repeat_MOSFET_IRF540/MOSFET_IRF5406 (5 pins), U_Repeat_MOSFET_IRLML0030/MOSFET_IRLML00301 (C13_MOSFET_IRLML00301.1 Q3_MOSFET_IRLML00301.2 R17_MOSFET_IRLML00301.1 U5_MOSFET_IRLML00301.1), U_Repeat_MOSFET_IRLML0030/MOSFET_IRLML00302 (C13_MOSFET_IRLML00302.1 Q3_MOSFET_IRLML00302.2 R17_MOSFET_IRLML00302.1 U5_MOSFET_IRLML00302.1), U_Repeat_MOSFET_IRLML0030/MOSFET_IRLML00303 (C13_MOSFET_IRLML00303.1 Q3_MOSFET_IRLML00303.2 R17_MOSFET_IRLML00303.1 U5_MOSFET_IRLML00303.1), U_Repeat_MOSFET_IRLML0030/MOSFET_IRLML00304 (C13_MOSFET_IRLML00304.1 Q3_MOSFET_IRLML00304.2 R17_MOSFET_IRLML00304.1 U5_MOSFET_IRLML00304.1), U_Repeat_MOSFET_IRLML0030/MOSFET_IRLML00305 (C13_MOSFET_IRLML00305.1 Q3_MOSFET_IRLML00305.2 R17_MOSFET_IRLML00305.1 U5_MOSFET_IRLML00305.1), U_Repeat_MOSFET_IRLML0030/MOSFET_IRLML00306 (C13_MOSFET_IRLML00306.1 Q3_MOSFET_IRLML00306.2 R17_MOSFET_IRLML00306.1 U5_MOSFET_IRLML00306.1)
VCC-3V3: LDO_3v3_LM2937 (C10.1 U3.3), MCLR_AVR (R16.2), PIC32MK_ACB (13 pins), UART_AVR (J1.4), Dynamixel_Servos_AXRX (C14.2 C15.2 U6.8 U7.8)
VCC-5V: BUCK_5v_TPS54340_P-MOS (C6.2 L1.2 R2.2), LDO_3v3_LM2937 (C9.2 U3.1)
VCC-12V: BUCK_5v_TPS54340_P-MOS (7 pins), Dynamixel_Servos_AXRX (P5.2 P6.2), U_Repeat_MOSFET_IRF540/MOSFET_IRF5401 (5 pins), U_Repeat_MOSFET_IRF540/MOSFET_IRF5402 (5 pins), U_Repeat_MOSFET_IRF540/MOSFET_IRF5403 (5 pins), U_Repeat_MOSFET_IRF540/MOSFET_IRF5404 (5 pins), U_Repeat_MOSFET_IRF540/MOSFET_IRF5405 (5 pins), U_Repeat_MOSFET_IRF540/MOSFET_IRF5406 (5 pins), U_Repeat_MOSFET_IRLML0030/MOSFET_IRLML00301 (C13_MOSFET_IRLML00301.2 D5_MOSFET_IRLML00301.1 J2_MOSFET_IRLML00301.2 U5_MOSFET_IRLML00301.3), U_Repeat_MOSFET_IRLML0030/MOSFET_IRLML00302 (C13_MOSFET_IRLML00302.2 D5_MOSFET_IRLML00302.1 J2_MOSFET_IRLML00302.2 U5_MOSFET_IRLML00302.3), U_Repeat_MOSFET_IRLML0030/MOSFET_IRLML00303 (C13_MOSFET_IRLML00303.2 D5_MOSFET_IRLML00303.1 J2_MOSFET_IRLML00303.2 U5_MOSFET_IRLML00303.3), U_Repeat_MOSFET_IRLML0030/MOSFET_IRLML00304 (C13_MOSFET_IRLML00304.2 D5_MOSFET_IRLML00304.1 J2_MOSFET_IRLML00304.2 U5_MOSFET_IRLML00304.3), U_Repeat_MOSFET_IRLML0030/MOSFET_IRLML00305 (C13_MOSFET_IRLML00305.2 D5_MOSFET_IRLML00305.1 J2_MOSFET_IRLML00305.2 U5_MOSFET_IRLML00305.3), U_Repeat_MOSFET_IRLML0030/MOSFET_IRLML00306 (C13_MOSFET_IRLML00306.2 D5_MOSFET_IRLML00306.1 J2_MOSFET_IRLML00306.2 U5_MOSFET_IRLML00306.3)
CAN_RX: PIC32MK_ACB (uC.30), CANbus (RXCAN1.1 U2.4)
CAN_TX: PIC32MK_ACB (uC.31), CANbus (TXCAN1.1 U2.1)
CONTROL_HP1: PIC32MK_ACB (uC.54), U_Repeat_MOSFET_IRF540/MOSFET_IRF5401 (U4_MOSFET_IRF5401.4)
CONTROL_HP2: PIC32MK_ACB (uC.53), U_Repeat_MOSFET_IRF540/MOSFET_IRF5402 (U4_MOSFET_IRF5402.4)
CONTROL_HP3: PIC32MK_ACB (uC.52), U_Repeat_MOSFET_IRF540/MOSFET_IRF5403 (U4_MOSFET_IRF5403.4)
CONTROL_HP4: PIC32MK_ACB (uC.50), U_Repeat_MOSFET_IRF540/MOSFET_IRF5404 (U4_MOSFET_IRF5404.4)
CONTROL_HP5: PIC32MK_ACB (uC.49), U_Repeat_MOSFET_IRF540/MOSFET_IRF5405 (U4_MOSFET_IRF5405.4)
CONTROL_HP6: PIC32MK_ACB (uC.51), U_Repeat_MOSFET_IRF540/MOSFET_IRF5406 (U4_MOSFET_IRF5406.4)
CONTROL_LP1: PIC32MK_ACB (uC.4), U_Repeat_MOSFET_IRLML0030/MOSFET_IRLML00301 (U5_MOSFET_IRLML00301.4)
CONTROL_LP2: PIC32MK_ACB (uC.8), U_Repeat_MOSFET_IRLML0030/MOSFET_IRLML00302 (U5_MOSFET_IRLML00302.4)
CONTROL_LP3: PIC32MK_ACB (uC.11), U_Repeat_MOSFET_IRLML0030/MOSFET_IRLML00303 (U5_MOSFET_IRLML00303.4)
CONTROL_LP4: PIC32MK_ACB (uC.12), U_Repeat_MOSFET_IRLML0030/MOSFET_IRLML00304 (U5_MOSFET_IRLML00304.4)
CONTROL_LP5: PIC32MK_ACB (uC.2), U_Repeat_MOSFET_IRLML0030/MOSFET_IRLML00305 (U5_MOSFET_IRLML00305.4)
CONTROL_LP6: PIC32MK_ACB (uC.13), U_Repeat_MOSFET_IRLML0030/MOSFET_IRLML00306 (U5_MOSFET_IRLML00306.4)
OSC1: PIC32MK_ACB (uC.39), 8MHz_Crystal (C17.2 Y1.1)
OSC2: PIC32MK_ACB (uC.40), 8MHz_Crystal (C18.2 Y1.3)
~{RESET}: MCLR_AVR (C16.2 R16.1 SW1.2), PIC32MK_ACB (P?.1 uC.7)
RS485-DIR: PIC32MK_ACB (uC.29), Dynamixel_Servos_AXRX (U7.2 U7.3)
RXD: PIC32MK_ACB (uC.32), Dynamixel_Servos_AXRX (U6.6)
RXD0/PDI: PIC32MK_ACB (uC.3), UART_AVR (J1.3)
SERVO-SELECT: PIC32MK_ACB (uC.28), Dynamixel_Servos_AXRX (U6.1 U6.5)
TXD: PIC32MK_ACB (uC.33), Dynamixel_Servos_AXRX (U6.10)
TXD0/PDO: PIC32MK_ACB (uC.1), UART_AVR (J1.2)